# EAGLE design LEDWatchsch (EAGLE 9.6.2)
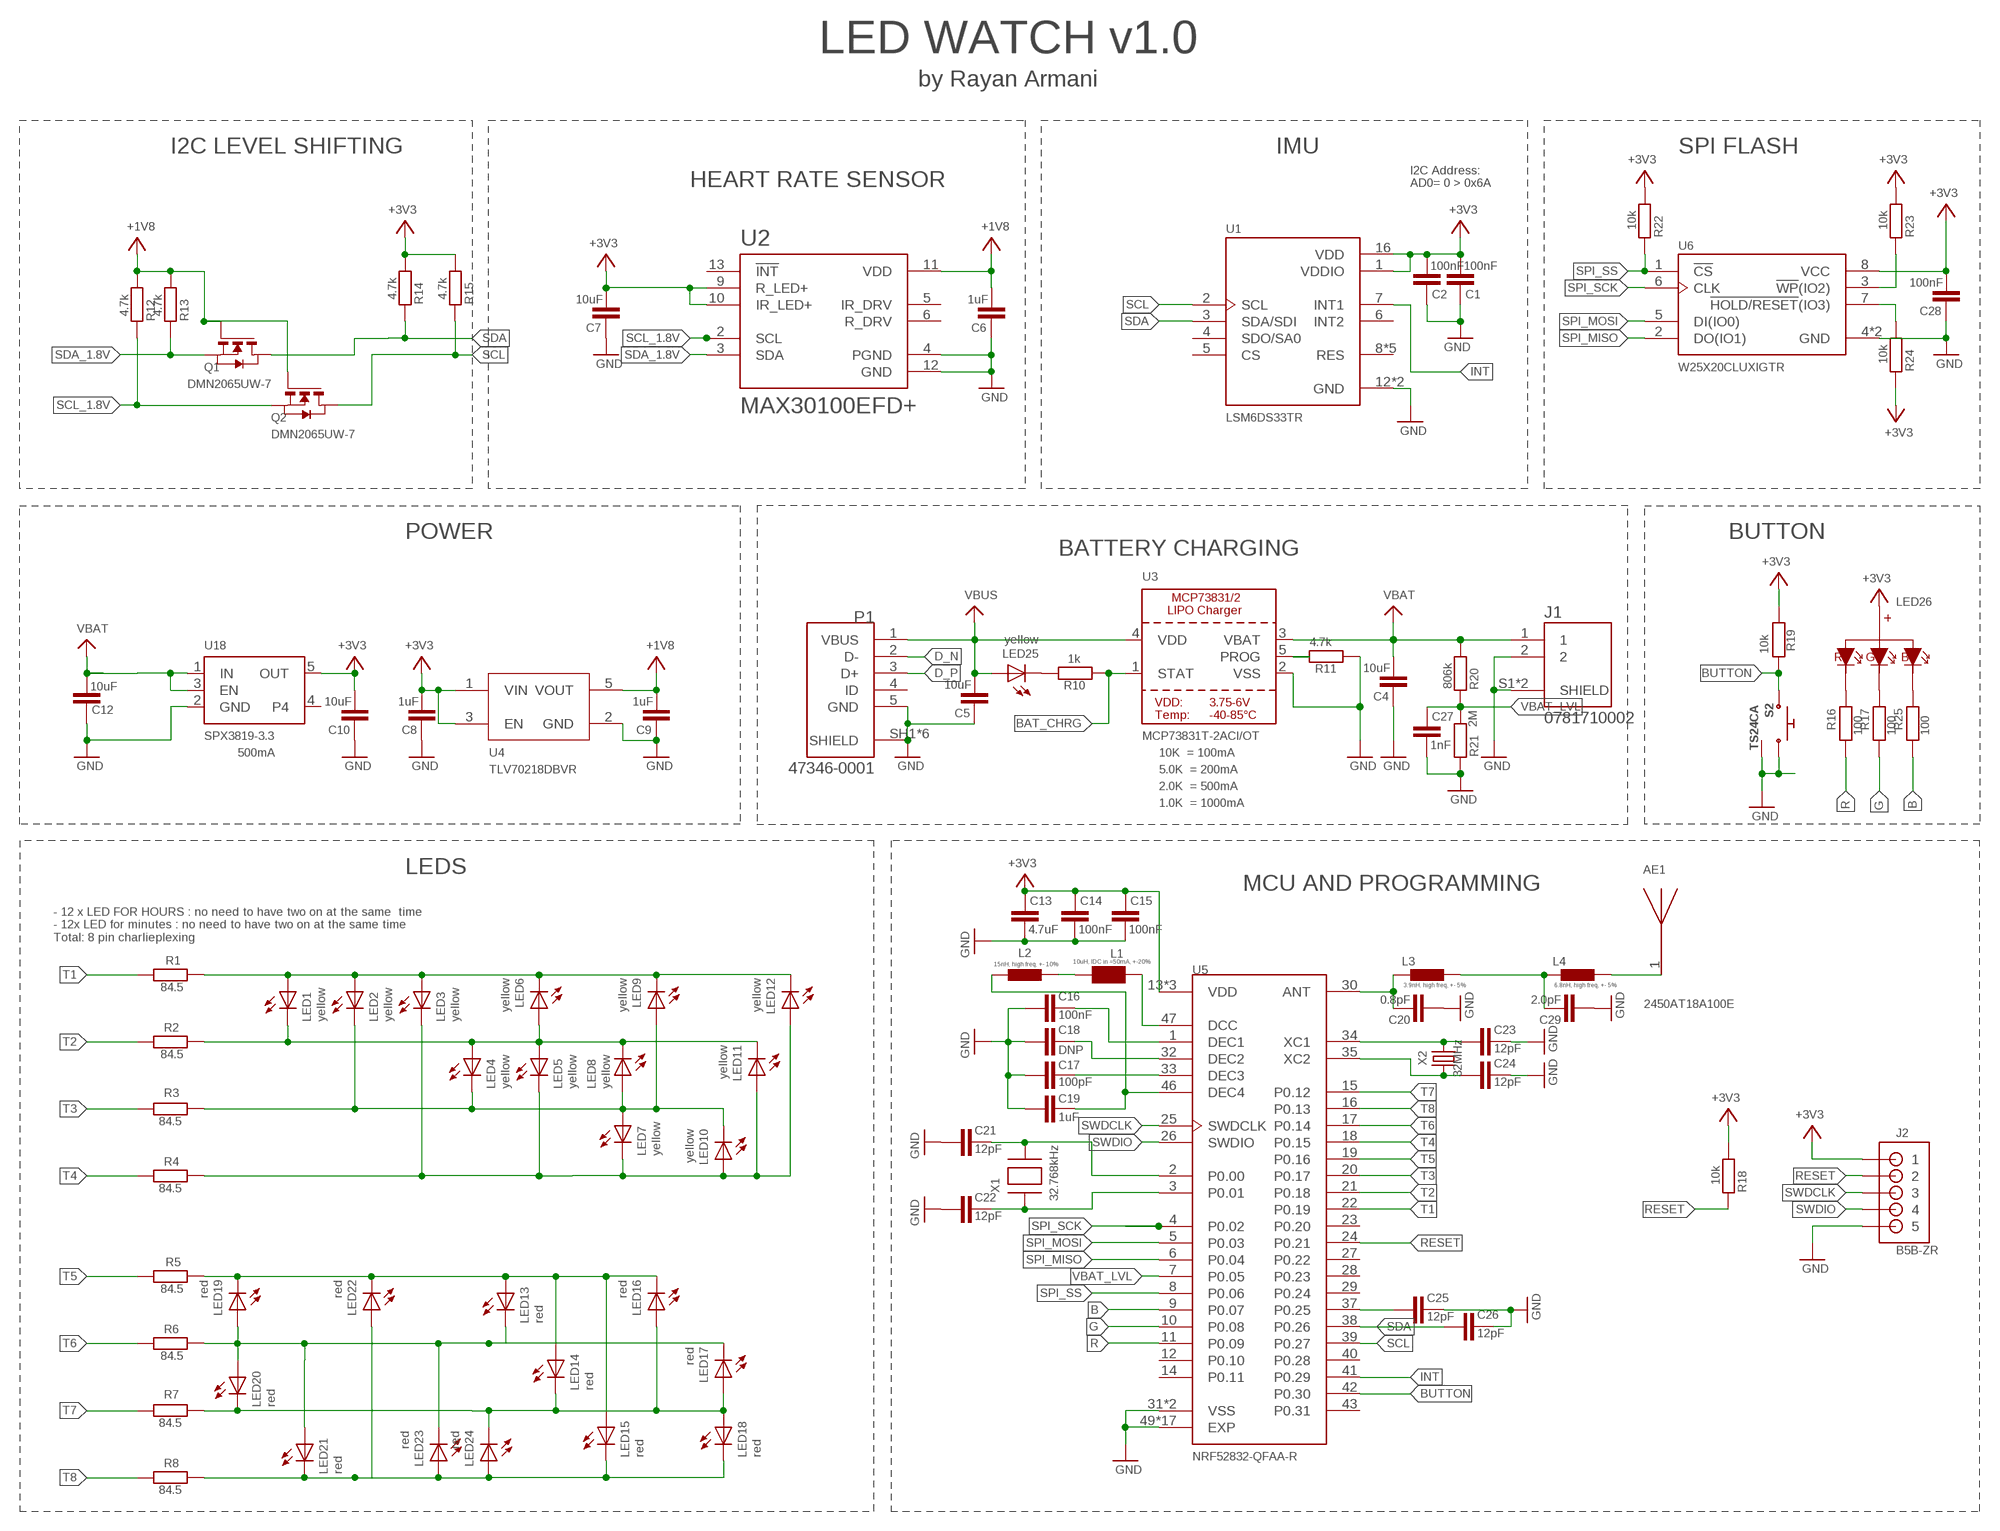
[diagram p0: schematic, sheet 1]

## Parts
AE1  2450AT18A100E  [ANTC3216X140N]
C1  100nF  C-EUC0402K  [C0402K]
C2  100nF  C-EUC0402K  [C0402K]
C4  10uF  C-EUC0402  [C0402]
C5  10uF  C-EUC0402  [C0402]
C6  1uF  C-EUC0402K  [C0402K]
C7  10uF  C-EUC0402  [C0402]
C8  1uF  C-EUC0402K  [C0402K]
C9  1uF  C-EUC0402K  [C0402K]
C10  10uF  C-EUC0402  [C0402]
C12  10uF  C-EUC0402  [C0402]
C13  4.7uF  C-EUC0603  [C0603]
C14  100nF  C-EUC0402  [C0402]
C15  100nF  C-EUC0402K  [C0402K]
C16  100nF  C-EUC0402  [C0402]
C17  100pF  C-EUC0402  [C0402]
C18  DNP  C-EUC0402  [C0402]
C19  1uF  C-EUC0603  [C0603]
C20  0.8pF  C-EUC0402  [C0402]
C21  12pF  C-EUC0402  [C0402]
C22  12pF  C-EUC0402  [C0402]
C23  12pF  C-EUC0402  [C0402]
C24  12pF  C-EUC0402  [C0402]
C25  12pF  C-EUC0402  [C0402]
C26  12pF  C-EUC0402  [C0402]
C27  1nF  C-EUC0402K  [C0402K]
C28  100nF  C-EUC0402K  [C0402K]
C29  2.0pF  C-EUC0402  [C0402]
J1  0781710002  [MOLEX_0781710002]
J2  B5B-ZR  [B5B-ZR]
L1  10uH, IDC in =50mA, +-20%  WUERTH-ELEKTRONIK_WE-CBF_0603  [WUERTH-ELEKTRONIK_0603]
L2  15nH, high freq, +- 10%  BLM15HB121SN1  [0402]
L3  3.9nH, high freq, +- 5%  BLM15HB121SN1  [0402]
L4  6.8nH, high freq, +- 5%  BLM15HB121SN1  [0402]
LED1  yellow  LEDCHIPLED_0603  [CHIPLED_0603]
LED2  yellow  LEDCHIPLED_0603  [CHIPLED_0603]
LED3  yellow  LEDCHIPLED_0603  [CHIPLED_0603]
LED4  yellow  LEDCHIPLED_0603  [CHIPLED_0603]
LED5  yellow  LEDCHIPLED_0603  [CHIPLED_0603]
LED6  yellow  LEDCHIPLED_0603  [CHIPLED_0603]
LED7  yellow  LEDCHIPLED_0603  [CHIPLED_0603]
LED8  yellow  LEDCHIPLED_0603  [CHIPLED_0603]
LED9  yellow  LEDCHIPLED_0603  [CHIPLED_0603]
LED10  yellow  LEDCHIPLED_0603  [CHIPLED_0603]
LED11  yellow  LEDCHIPLED_0603  [CHIPLED_0603]
LED12  yellow  LEDCHIPLED_0603  [CHIPLED_0603]
LED13  red  LEDCHIPLED_0603  [CHIPLED_0603]
LED14  red  LEDCHIPLED_0603  [CHIPLED_0603]
LED15  red  LEDCHIPLED_0603  [CHIPLED_0603]
LED16  red  LEDCHIPLED_0603  [CHIPLED_0603]
LED17  red  LEDCHIPLED_0603  [CHIPLED_0603]
LED18  red  LEDCHIPLED_0603  [CHIPLED_0603]
LED19  red  LEDCHIPLED_0603  [CHIPLED_0603]
LED20  red  LEDCHIPLED_0603  [CHIPLED_0603]
LED21  red  LEDCHIPLED_0603  [CHIPLED_0603]
LED22  red  LEDCHIPLED_0603  [CHIPLED_0603]
LED23  red  LEDCHIPLED_0603  [CHIPLED_0603]
LED24  red  LEDCHIPLED_0603  [CHIPLED_0603]
LED25  yellow  LEDCHIPLED_0603  [CHIPLED_0603]
LED26  RGB_CAV1  [19-037A/RSGHBHW]
P1  47346-0001  [MOLEX_47346-0001]
Q1  DMN2065UW-7  NMOS-SOT323  [SOT323]
Q2  DMN2065UW-7  NMOS-SOT323  [SOT323]
R1  84.5  R-EU_R0402  [R0402]
R2  84.5  R-EU_R0402  [R0402]
R3  84.5  R-EU_R0402  [R0402]
R4  84.5  R-EU_R0402  [R0402]
R5  84.5  R-EU_R0402  [R0402]
R6  84.5  R-EU_R0402  [R0402]
R7  84.5  R-EU_R0402  [R0402]
R8  84.5  R-EU_R0402  [R0402]
R10  1k  R-EU_R0402  [R0402]
R11  4.7k  R-EU_R0402  [R0402]
R12  4.7k  R-EU_R0402  [R0402]
R13  4.7k  R-EU_R0402  [R0402]
R14  4.7k  R-EU_R0402  [R0402]
R15  4.7k  R-EU_R0402  [R0402]
R16  100  R-EU_R0402  [R0402]
R17  100  R-EU_R0402  [R0402]
R18  10k  R-EU_R0402  [R0402]
R19  10k  R-EU_R0402  [R0402]
R20  806k  R-EU_R0402  [R0402]
R21  2M  R-EU_R0402  [R0402]
R22  10k  R-EU_R0402  [R0402]
R23  10k  R-EU_R0402  [R0402]
R24  10k  R-EU_R0402  [R0402]
R25  100  R-EU_R0402  [R0402]
S2  TS24CA  PUSHBUTTON_SHIELDED_NH  [TS24CCA_NOHOLE]
U1  LSM6DS33TR  [PQFN50P300X300X86-16N]
U2  MAX30100EFD+  [LGA14R80P2X7_560X280X130]
U3  MCP73831T-2ACI/OT  MCP73831/2  [SOT23-5]
U4  TLV70218DBVR  TLV702TLV702  [SOT95P280X145-5N]
U5  NRF52832-QFAA-R  [QFN40P600X600X90-49N]
U6  W25X20CLUXIGTR  [SON50P300X200X60-9N]
U18  SPX3819-3.3  VREG_SOT23-5  [SOT23-5]
X1  32.768kHz  XTAL-3.2X1.5  [XTAL3215]
X2  32MHz  KX-5  [2.0X1.6_KX-5]

## Nets
+3V3: C1.2 C2.2 C7.2 C8.2 C10.2 C13.1 C14.1 C15.1 C28.2 J2.1 LED26.A R14.1 R15.1 R18.1 R19.1 R22.1 R23.1 R24.2 U1.1(VDDIO) U1.16(VDD) U2.9(R_LED+) U2.10(IR_LED+) U4.1(VIN) U4.3(EN) U5.13(VDD) U5.36(VDD) U5.48(VDD) U6.8(VCC) U18.5(OUT)
ANT: C29.1 L3.2 L4.1
B: R25.1 U5.9(P0.07)
BAT_CHRG: R10.1 U3.1(STAT)
BUTTON: R19.2 S2.1 U5.42(P0.30)
D_N: P1.2(D-)
D_P: P1.3(D+)
G: R17.1 U5.10(P0.08)
GND: C1.1 C2.1 C4.1 C5.1 C6.1 C7.1 C8.1 C9.1 C10.1 C12.1 C13.2 C14.2 C15.2 C16.2 C17.2 C18.2 C19.1 C20.2 C21.2 C22.2 C23.1 C24.1 C25.1 C26.1 C27.2 C28.1 C29.2 J1.2 J1.S1(SHIELD) J1.S2(SHIELD) J2.5 P1.5(GND) P1.SH1(SHIELD) P1.SH2(SHIELD) P1.SH3(SHIELD) P1.SH4(SHIELD) P1.SH5(SHIELD) P1.SH6(SHIELD) R11.1 R21.2 S2.2 S2.P$3(SHIELD) S2.P$4(SHIELD) U1.12(GND) U1.13(GND) U2.4(PGND) U2.12(GND) U3.2(VSS) U4.2(GND) U5.31(VSS) U5.45(VSS) U5.49(EXP) U5.50(EXP) U5.51(EXP) U5.52(EXP) U5.53(EXP) U5.54(EXP) U5.55(EXP) U5.56(EXP) U5.57(EXP) U5.58(EXP) U5.59(EXP) U5.60(EXP) U5.61(EXP) U5.62(EXP) U5.63(EXP) U5.64(EXP) U5.65(EXP) U6.4(GND) U6.9(GND) U18.2(GND)
H1: LED1.A LED2.A LED3.A LED6.C LED9.C LED12.C R1.2
H2: LED1.C LED4.A LED5.A LED6.A LED8.C LED11.C R2.2
H3: LED2.C LED4.C LED7.A LED8.A LED9.A LED10.C R3.2
H4: LED3.C LED5.C LED7.C LED10.A LED11.A LED12.A R4.2
H5: LED13.A LED14.A LED15.A LED16.C LED19.C LED22.C R5.2
H6: LED13.C LED17.C LED19.A LED20.A LED21.A LED23.C R6.2
H7: LED14.C LED16.A LED17.A LED18.A LED20.C LED24.C R7.2
H8: LED15.C LED18.C LED21.C LED22.A LED23.A LED24.A R8.2
INT: U1.7(INT1) U5.41(P0.29)
N$3: LED25.C R10.2
N$4: C16.1 U5.1(DEC1)
N$5: R11.2 U3.5(PROG)
N$6: C18.1 U5.32(DEC2)
N$7: LED26.B R25.2
N$8: C17.1 U5.33(DEC3)
N$9: C19.2 L2.2 U5.46(DEC4)
N$10: L1.1 U5.47(DCC)
N$11: L1.2 L2.1
N$12: C20.1 L3.1 U5.30(ANT)
N$13: C21.1 U5.2(P0.00) X1.P$2
N$14: C22.1 U5.3(P0.01) X1.P$1
N$15: C23.2 U5.34(XC1) X2.3
N$16: C24.2 U5.35(XC2) X2.1
N$17: C25.2 U5.37(P0.25)
N$18: R23.2 U6.3(!WP!(IO2))
N$19: R24.1 U6.7(!HOLD/RESET!(IO3))
N$20: AE1.1 L4.2
N$21: LED26.R R16.2
N$22: LED26.G R17.2
R: R16.1 U5.11(P0.09)
RESET: J2.2 R18.2 U5.24(P0.21)
SCL: Q2.3(D) R15.2 U1.2(SCL) U5.39(P0.27)
SCL_1.8V: Q2.2(S) R12.2 U2.2(SCL)
SDA: C26.2 Q1.3(D) R14.2 U1.3(SDA/SDI) U5.38(P0.26)
SDA_1.8V: Q1.2(S) R13.2 U2.3(SDA)
SPI_MISO: U5.6(P0.04) U6.2(DO(IO1))
SPI_MOSI: U5.5(P0.03) U6.5(DI(IO0))
SPI_SCK: U5.4(P0.02) U6.6(CLK)
SPI_SS: R22.2 U5.8(P0.06) U6.1(!CS)
SWDCLK: J2.3 U5.25(SWDCLK)
SWDIO: J2.4 U5.26(SWDIO)
T1: R1.1 U5.22(P0.19)
T2: R2.1 U5.21(P0.18)
T3: R3.1 U5.20(P0.17)
T4: R4.1 U5.18(P0.15)
T5: R5.1 U5.19(P0.16)
T6: R6.1 U5.17(P0.14)
T7: R7.1 U5.15(P0.12)
T8: R8.1 U5.16(P0.13)
VBAT: C4.2 C12.2 J1.1 R20.1 U3.3(VBAT) U18.1(IN) U18.3(EN)
VBAT_LVL: C27.1 R20.2 R21.1 U5.7(P0.05)
VBUS: C5.2 LED25.A P1.1(VBUS) U3.4(VDD)
VCC: C6.2 C9.2 Q1.1(G) Q2.1(G) R12.1 R13.1 U2.11(VDD) U4.5(VOUT) ; supply symbol labelled +1V8
Unconnected: P1.4(ID) U1.4(SDO/SA0) U1.5(CS) U1.6(INT2) U1.8(RES) U1.9(RES) U1.10(RES) U1.11(RES) U1.15(RES) U2.5(IR_DRV) U2.6(R_DRV) U2.13(!INT) U5.12(P0.10) U5.14(P0.11) U5.23(P0.20) U5.27(P0.22) U5.28(P0.23) U5.29(P0.24) U5.40(P0.28) U5.43(P0.31) U18.4

## Notes on the sheet
- LED WATCH v1.0
- by Rayan Armani
- I2C LEVEL SHIFTING | IMU | SPI FLASH
- HEART RATE SENSOR
- I2C Address: 
  AD0= 0 > 0x6A
- POWER | BUTTON
- BATTERY CHARGING
- 500mA | 10K  = 100mA
- 5.0K  = 200mA
- 2.0K  = 500mA
- 1.0K  = 1000mA
- LEDS
- MCU AND PROGRAMMING
- - 12 x LED FOR HOURS : no need to have two on at the same  time
  - 12x LED for minutes : no need to have two on at the same time 
  Total: 8 pin charlieplexing

## Library data of the parts
AE1 = 2450AT18A100E:2450AT18A100E: ANTENNA, CERAMIC, 2.45GHZ; Bandwidth: 100MHz; Frequency: 2.45GHz; Gain: -0.5dB; Impedance: 50ohm; AVAILABILITY: Unavailable; DESCRIPTION: 2.4GHz Chip RF Antenna 2.4GHz ~ 2.5GHz 0.5dBi Solder Surface Mount; MF: Johanson Technology; MP: 2450AT18A100E; PACKAGE: FBGA-780 Johanson; PRICE: None
C1 C2 C4-C10 C12-C29 = rcl:C-EU: CAPACITOR, European symbol; SPICEPREFIX: C
J1 = Molex_picoblade:0781710002: Conn Wire to Board HDR 2 POS 1.2mm Solder ST SMD; AVAILABILITY: Unavailable; DESCRIPTION: Connector Header Surface Mount 2 position 0.047 _1.20mm_; MF: Molex; MP: 0781710002; PACKAGE: None; PRICE: None
J2 = con-jst-zh:B5B-ZR: JST-ZH Connector 5 pol, 1.5mm pitch Package: B5B-ZR Source: http://www.jst-mfg.com/product/pdf/eng/eZH.pdf
L1 = Arduino_Micro:WUERTH-ELEKTRONIK_WE-CBF: SMD EMI Suppression Ferrite Beads - excellent anti-EMI properties - low DCR - impedances till 3000 ohms - rated current up to 6 A
L2-L4 = inductors:BLM15H: EMIFIL (R) Chip Ferrite Bead for GHz Noise Source: http://www.murata.com/ Ferrite Bead BLM15H.pdf
LED1-LED25 = adafruit:LED: LED OSRAM: - CHIPLED LG R971, LG N971, LY N971, LG Q971, LY Q971, LO R971, LY R971 LH N974, LH R974 LS Q976, LO Q976, LY Q976 LO Q996 - Hyper CHIPLED LW Q18S LB Q993, LB Q99A, LB R99A - SideLED LS A670, LO A670, LY A670, LG A670, LP A670 LB A673, LV A673, LT A673, LW A673 LH A674 LY A675 LS A676, LA A676, LO A676, LY A676, LW A676 LS A679, LY A679, LG A679 - Hyper Micro SIDELED® LS Y876, LA Y876, LO Y876, LY Y876 LT Y87S - SmartLED LW L88C, LW L88S LB L89C, LB L89S, LG L890 LS L89K, LO L89K, LY L89K LS L896, LA L896, LO L896, LY L896 - TOPLED LS T670, LO T670, LY T670, LG T670, LP T670 LSG T670, LSP T670, LSY T670, LOP T670, LYG T670 LG T671, LOG T671, LSG T671 LB T673, LV T673, LT T673, LW T673 LH T674 LS T676, LA T676, LO T676, LY T676, LB T676, LH T676, LSB T676, LW T676 LB T67C, LV T67C, LT T67C, LS T67K, LO T67K, LY T67K, LW E67C LS E67B, LA E67B, LO E67B, LY E67B, LB E67C, LV E67C, LT E67C LW T67C LS T679, LY T679, LG T679 LS T770, LO T770, LY T770, LG T770, LP T770 LB T773, LV T773, LT T773, LW T773 LH T774 LS E675, LA E675, LY E675, LS T675 LS T776, LA T776, LO T776, LY T776, LB T776 LHGB T686 LT T68C, LB T68C - Hyper Mini TOPLED® LB M676 - Mini TOPLED Santana® LG M470 LS M47K, LO M47K, LY M47K Source: http://www.osram.convergy.de/
LED26 = RGB:RGB_CA
P1 = 47346-0001:47346-0001: CONN RCPT 5POS MICRO USB R/A SMD; AVAILABILITY: Unavailable; DESCRIPTION: USB - micro B USB 2.0 Receptacle Connector 5 Position Surface Mount, Right Angle; MF: Molex; MP: 47346-0001; PACKAGE: None; PRICE: None
Q1 Q2 = MOSFET:NMOS: N-Channel MOSFET
R1-R8 R10-R25 = rcl:R-EU_: RESISTOR, European symbol; SPICEPREFIX: R
S2 = Inbolt:PUSHBUTTON_SHIELDED
U1 = LSM6DS33TR:LSM6DS33TR: Integrated Circuit, Misc s 3d Accelerometer And Gyro Lsm6ds3; AVAILABILITY: Unavailable; DESCRIPTION: Integrated Circuit, Misc s 3d Accelerometer And Gyro Lsm6ds3; MF: STMicroelectronics; MP: LSM6DS33TR; PACKAGE: LGA-16 STMicroelectronics; PRICE: None
U2 = MAX30100EFD:MAX30100EFD+: Pulse Oximeter and Heart-Rate Sensor IC 14-Pin OLGA; AVAILABILITY: Unavailable; DESCRIPTION: Oximeter/Heart Rate Sensor Output; MF: Maxim Integrated; MP: MAX30100EFD+T; PACKAGE: None; PRICE: None
U3 = microbuilder:MCP73831/2: MCP73831/2 LIPO Charger VDD: 3.75 - 6V Temp -40 - 85°C Programmable Charge Rate: 15-500mA NOTE: STAT is a tri-state logic output on the MCP73831 and an open-drain output on the MCP73832. SOT23-5 with 4.2V output and tri-state logic on STAT = MCP73831T-2ACI/OT
U4 = Inbolt:TLV702
U5 = NRF52832-QFAA-R:NRF52832-QFAA-R: Bluetooth SMART SOC IoT 2000Mbps 48-Pin QFN EP T/R; AVAILABILITY: Unavailable; DESCRIPTION: IC RF TxRx + MCU Bluetooth, General ISM > 1GHz ANT, Bluetooth v5.0 2.4GHz 48-VFQFN Exposed Pad; MF: Nordic; MP: NRF52832-QFAA-R; PACKAGE: VFQFN-48 Nordic; PRICE: None
U6 = Memory:W25X20CLUXIGTR
U18 = microbuilder:VREG_SOT23-5: SOT23-5 Fixed Voltage Regulators Part Current Out V Out V In V Dropout θJA (°C/W) TJ (°C) Digikey Part No. ADP121 150mA 3.3V 3.4-5.5V 0.09V @ 150mA -- -- ADP121-AUJZ33R7CT-ND ADP121 150mA 3.0V 3.1-5.5V 0.09V @ 150mA -- -- ADP121-AUJZ30R7CT-ND ADP122 300mA 3.3V 3.4-5.5V 0.085V @ 300mA -- -- ADP122AUJZ-3.3-R7CT-ND ADP1712 300mA 3.3V 3.5-5.5V 0.17V @ 300mA -- -- ADP1712AUJZ-3.3-R7TR-ND AP7311 (Low Cost) 150mA 3.3V 3.5-6V 0.15V @ 150mA -- -- AP7311-33WG-7DICT-ND LD39015M18R 150mA 1.8V 1.9V-5.5V 0.08V @ 100mA -- -- 497-6977-1-ND LP2985A-33DBVR 150mA 3.3V 3.3-16V 0.28V @ 150mA 206 150 296-18479-1-ND MCP1824T-3302E/OT 300mA 3.3V 3.5V-6V 0.2V @ 300mA -- -- MCP1824T-3302E/OTCT-ND MIC5205-2.5YM5 TR 150mA 2.5V 2.7-16V 0.165V @ 150mA -- -- 576-1257-2-ND MIC5205-3.0YM5 TR 150mA 3.0V 3.2V-16V 0.165V @ 150mA -- -- 576-1258-2-ND MIC5205-3.3YM5 TR 150mA 3.3V 3.5V-16V 0.165V @ 150mA -- -- 576-1259-2-ND TPS780330220 150mA 3.3V+2.2V 3.6-5.5V 250mV Max -- -- 296-23332-1-ND TDA3663/N1,135 100mA 3.3V 3.5-45V 0.18V @ 50mA -- -- 568-5343-1-ND Max operating temp can be calculated using θJA, TJ (max junction temperature), and power in watts. Set the "Maximum Ambient Temperature" until it reaches TJ ("Max Junction Temperature"), which is the absolute limit for safe use of the regulator: Heat Sink Temperature Calculator <http://www.daycounter.com/Calculators/Heat-Sink-Temperature-Calculator.phtml> For example, With 12V source into a 3.3V LP2985 and a 30mA load, we are dissipating (12V-3.3V) * 0.03A = 0.261W. With a θJA of 206 °C/W, a TJ of 150°C, and 261mW we can safely use the chip without a heat sink up to 75°C (=147.1°C Junction Temperature).
X1 = adafruit:XTAL: Low cost SMT crystals, no capacitors included http://www.ladyada.net/library/eagle
X2 = crystal-geyer_V1_0:KX: Quartz Crystals (MHz) SMD: KX - Serie Model Size l/w/h [mm] Frequency Range Frequency Stability Temp. Range [°C] Load Capacitance AECQ 200 availabel Datasheet KX-4 KX-5 KX-6 KX-7 KX-9A KX-9B KX-12A KX-12B KX-13 KX-20 KX-K KX-KS 1.6/1.2/0.3 2.0/1.6/0.45 2.5/2.0/0.55 3.2/2.5/0.8 5.0/3.2/1.0 5.0/3.2/1.1 6.0/3.5/1.1 6.0/3.5/1.0 7.0/5.0 /1.3 11.6/5.5/1.6 12.3/4.5/4.2 12.3/4.5/3.2 24.0 ~ 80.0 MHz 16.0 ~ 80.0 MHz 12.0 ~ 80.0 MHz 8.0 ~ 60.0 MHz 7,68 ~ 300,0 MHz 8,0 ~ 50,0 MHz 8,0 ~ 150,0 MHz 8,0 ~ 50,0 MHz 6,0 ~ 160,0 MHz 3,579 ~ 25,0 MHz 3,579 ~ 70,0 MHz 3,579 ~ 70,0 MHz ±10 … ±50ppm ±10 … ±50ppm ±10 … ±50ppm ±10 … ±50ppm ±10 … ±50ppm ±10 … ±50ppm ±10 … ±50ppm ±10 … ±50ppm ±10 … ±50ppm ±50ppm ±10 … ±50ppm ±10 … ±50ppm (*) -40°C …+85°C (*) -40°C …+125°C (*) -40°C …+125°C (*) -40°C …+125°C (*) -40°C …+105°C (*) -40°C …+105°C (*) -40°C …+125°C (*) -40°C …+105°C (*) -40°C …+105°C (*) -40°C …+105°C (*) -40°C …+85°C (*) -40°C …+85°C 8, 8…16 8, 8…16 10, 8…16 12, 7…20 16, 10…20 16, 10…20 16, 10…20 16, 12…20 16, 12…20 16, 12…20 16, 12…30 16, 12…30 - yes yes yes - - - - - - - - KX-4.pdf <http://www.geyer-electronic.de/uploads/tx_userartikelfrequenz/GEYER-KX-4.pdf> KX-5.pdf <http://www.geyer-electronic.de/uploads/tx_userartikelfrequenz/GEYER-KX-5.pdf> KX-6.pdf <http://www.geyer-electronic.de/uploads/tx_userartikelfrequenz/GEYER-KX-6.pdf> KX-7.pdf <http://www.geyer-electronic.de/uploads/tx_userartikelfrequenz/GEYER-KX-7.pdf> KX-9A.pdf <http://www.geyer-electronic.de/uploads/tx_userartikelfrequenz/GEYER-KX-9A.pdf> KX-9B.pdf <http://www.geyer-electronic.de/uploads/tx_userartikelfrequenz/GEYER-KX-9B.pdf> KX-12A.pdf <http://www.geyer-electronic.de/uploads/tx_userartikelfrequenz/GEYER-KX-12A.pdf> KX-12B.pdf <http://www.geyer-electronic.de/uploads/tx_userartikelfrequenz/GEYER-KX-12B.pdf> KX-13.pdf <http://www.geyer-electronic.de/uploads/tx_userartikelfrequenz/GEYER-KX-13.pdf> KX-20.pdf <http://www.geyer-electronic.de/uploads/tx_userartikelfrequenz/GEYER-KX-20.pdf> KX-K.pdf <http://www.geyer-electronic.de/uploads/tx_userartikelfrequenz/GEYER-KX-K.pdf> KX-KS.pdf <http://www.geyer-electronic.de/uploads/tx_userartikelfrequenz/GEYER-KX-KS.pdf> <http://www.geyer-electronic.de/fileadmin/template/img/logo-geyer-electronic.png> Details see: http://www.geyer-electronic.de/Frequenz-Produkte.9.0.html Created 2016-06-07, Hans Locher 2016 (C) Geyer Quartz Technology KX4,KX5,KX6,KX7,KX9A,KX9B,KX12A,KX12B,KX13,KX20,KXK,KXKS;1612;2016;2520;3225;5032;6035;7050;11655;12345;1,6x1,2;2,0x1,6;2,5x2,0;3,2x2,5;5,0x3,2;6,0x3,5;7,0x5,0;11,6x5,5;12,3x4,5;12,3x4,5;1.6x1.2;2.0x1.6;2.5x2.0;3.2x2.5;5.0x3.2;6.0x3.5;7.0x5.0;11.6x5.5;12.3x4.5;12.3x4.5;

## Net classes
0 default: width 0.152 mm, drill 0.3 mm, clearance 0.152 mm

## Board
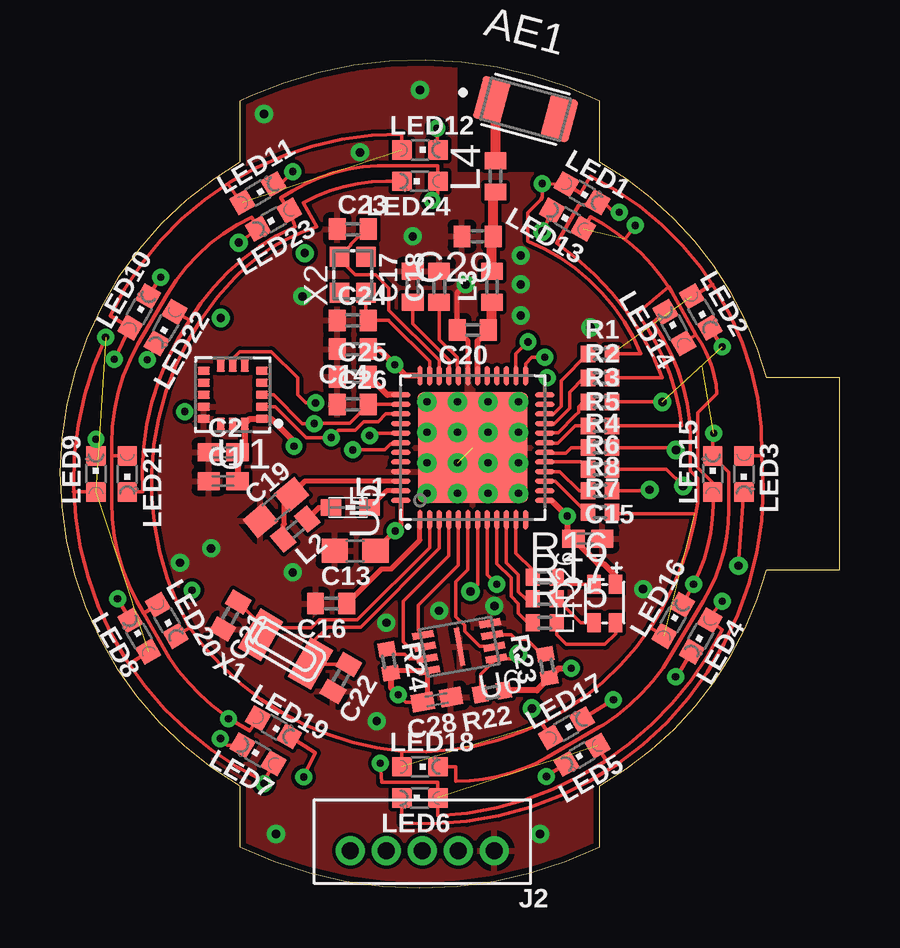
[diagram p1: board, top side]
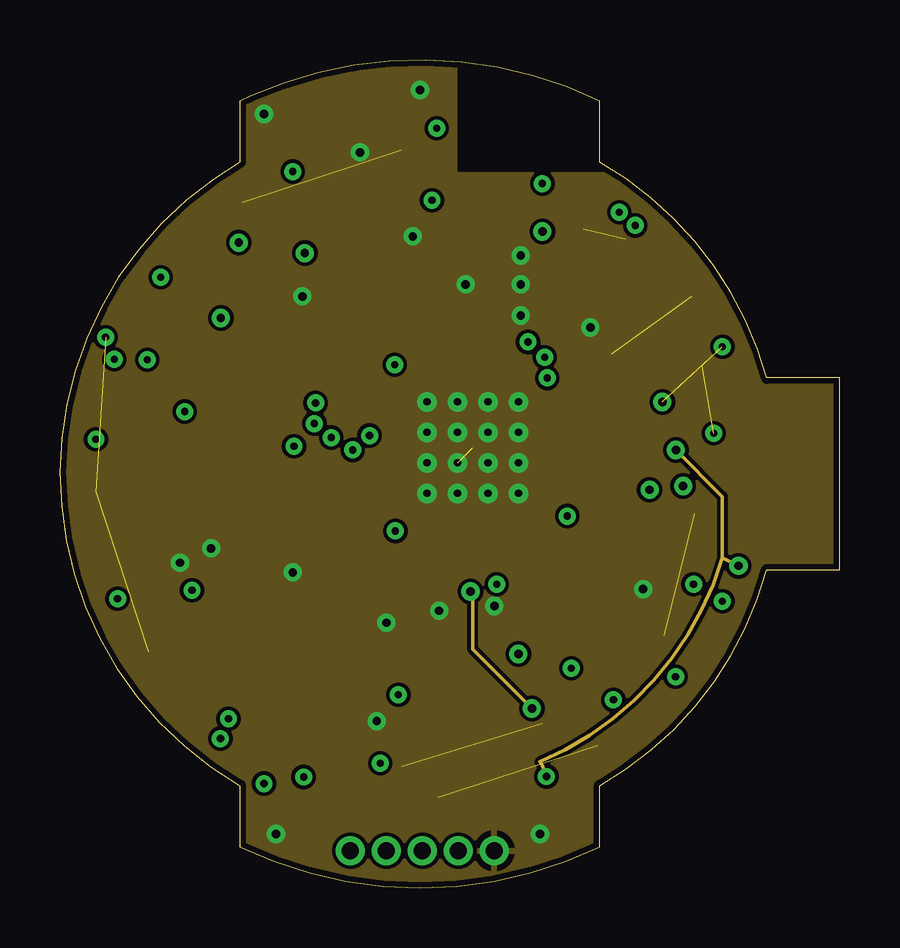
[diagram p2: board, inner layer GND]
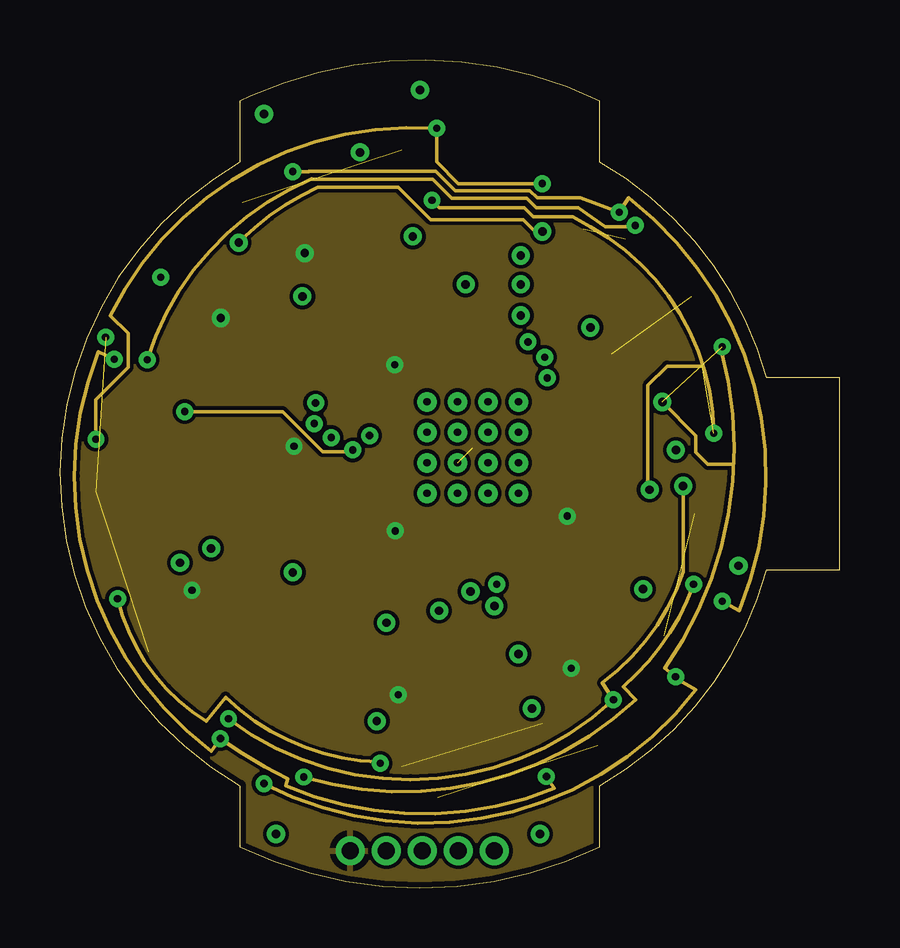
[diagram p3: board, inner layer VDD]
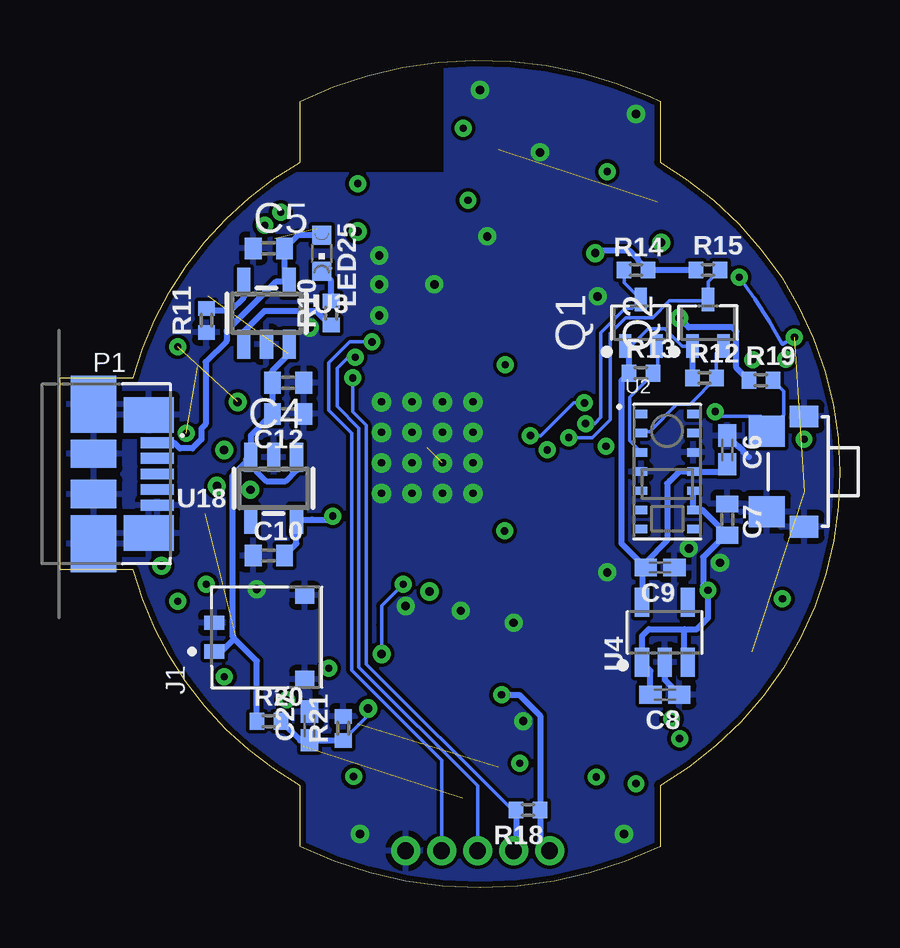
[diagram p4: board, bottom side, seen from below]

Size 32.5 x 34.5 mm. Coordinates in mm from the lower left corner, seen from the top.
Outline: 7.5,1.72 arc52 22.5,1.72 22.5,4.26 23.6,4.96 arc40 29.46,13.25 32.5,13.25 32.5,21.25 29.46,21.25 29.05,22.49 arc40 22.5,30.24 22.5,32.78 21.12,33.38 arc45 7.92,32.98 7.5,32.78 7.5,30.24 6.4,29.54 arc115 7.5,4.26 7.5,1.72
Copper layers (1+2*15+16): Top 0.04mm / dielectric 0.2mm / GND 0.04mm / dielectric 0.24mm / VDD 0.04mm / dielectric 0.2mm / Bottom 0.04mm
Design rules "default *": minimum track width 6mil, minimum drill 0.3mm, track to track 5mil, track to pad 5mil, pad to pad 5mil, via to via 5mil, smd to smd 5mil, copper to edge 10mil, drill to drill 6mil, minimum pad ring 10mil, minimum via ring 8mil, stop-mask expansion 4mil, vias tented up to drill 0.3mm, thermal gap 10mil

### Footprints (pad centres in the part's own frame; a part is rotated, then mirrored left to right if it is on the bottom)
ANTC3216X140N = smd 1.2 x 1.82: 1 -1.46,0; 2 1.46,0
C0402K = smd 0.925 x 0.74: 1 -0.6,0; 2 0.6,0
C0402 = smd 0.7 x 0.9: 1 -0.65,0; 2 0.65,0
C0603 = smd 1.1 x 1: 1 -0.85,0; 2 0.85,0
MOLEX_0781710002 = smd 0.6 x 0.85: 1 -0.6,3.775; 2 0.6,3.775 | smd 0.7 x 0.8: S1 -1.75,0; S2 1.75,0
B5B-ZR = drill 0.7: 1 7.5,-1.3; 2 6,-1.3; 3 4.5,-1.3; 4 3,-1.3; 5 1.5,-1.3
WUERTH-ELEKTRONIK_0603 = smd 0.85 x 0.7: 1 -0.9,0; 2 0.7,0
0402 = smd 0.7 x 0.9: 1 -0.65,0; 2 0.65,0
CHIPLED_0603 = smd 0.8 x 0.8: A 0,-0.75; C 0,0.75
19-037A/RSGHBHW = smd 0.8 x 0.55: A 0.8,-0.45; B -0.8,-0.45; G -0.8,0.45; R 0.8,0.45
MOLEX_47346-0001 = smd 0.45 x 1.38: 1 -1.3,2.66; 2 -0.65,2.66; 3 0,2.66; 4 0.65,2.66; 5 1.3,2.66 | smd 1.475 x 2.1: SH1 -2.462,2.3; SH2 2.462,2.3 | smd 2.375 x 1.9: SH3 -2.913,0; SH6 2.913,0 | smd 1.175 x 1.9: SH4 -0.838,0; SH5 0.838,0
SOT323 = smd 0.988 x 0.51: 1 -0.97,0.65; 2 -0.97,-0.65; 3 0.97,0
R0402 = smd 0.6 x 0.7: 1 -0.5,0; 2 0.5,0
TS24CCA_NOHOLE = smd 1.3 x 1.5: 1 -1.675,-1.55; 2 1.675,-1.55 | smd 0.9 x 1.2: P$3 -2.3,0; P$4 2.3,0
PQFN50P300X300X86-16N = smd 0.51 x 0.35: 1 -1.21,1; 2 -1.21,0.5; 3 -1.21,0; 4 -1.21,-0.5; 5 -1.21,-1; 9 1.21,-1; 10 1.21,-0.5; 11 1.21,0; 12 1.21,0.5; 13 1.21,1 | smd 0.35 x 0.51: 6 -0.5,-1.21; 7 0,-1.21; 8 0.5,-1.21; 14 0.5,1.21; 15 0,1.21; 16 -0.5,1.21
LGA14R80P2X7_560X280X130 = smd 0.5 x 0.35: 1 -1.075,2.4; 2 -1.075,1.6; 3 -1.075,0.8; 4 -1.075,0; 5 -1.075,-0.8; 6 -1.075,-1.6; 7 -1.075,-2.4; 8 1.075,-2.4; 9 1.075,-1.6; 10 1.075,-0.8; 11 1.075,0; 12 1.075,0.8; 13 1.075,1.6; 14 1.075,2.4
SOT23-5 = smd 0.55 x 1.2: 1 -0.95,-1.3; 2 0,-1.3; 3 0.95,-1.3; 4 0.95,1.3; 5 -0.95,1.3
SOT95P280X145-5N = smd 1.216 x 0.589: 1 -1.25,0.95; 2 -1.25,0; 3 -1.25,-0.95; 4 1.25,-0.95; 5 1.25,0.95
QFN40P600X600X90-49N = smd 0.8 x 0.2: 1 -3,2.2; 2 -3,1.8; 3 -3,1.4; 4 -3,1; 5 -3,0.6; 6 -3,0.2; 7 -3,-0.2; 8 -3,-0.6; 9 -3,-1; 10 -3,-1.4; 11 -3,-1.8; 12 -3,-2.2; 25 3,-2.2; 26 3,-1.8; 27 3,-1.4; 28 3,-1; 29 3,-0.6; 30 3,-0.2; 31 3,0.2; 32 3,0.6; 33 3,1; 34 3,1.4; 35 3,1.8; 36 3,2.2 | smd 0.2 x 0.8: 13 -2.2,-3; 14 -1.8,-3; 15 -1.4,-3; 16 -1,-3; 17 -0.6,-3; 18 -0.2,-3; 19 0.2,-3; 20 0.6,-3; 21 1,-3; 22 1.4,-3; 23 1.8,-3; 24 2.2,-3; 37 2.2,3; 38 1.8,3; 39 1.4,3; 40 1,3; 41 0.6,3; 42 0.2,3; 43 -0.2,3; 44 -0.6,3; 45 -1,3; 46 -1.4,3; 47 -1.8,3; 48 -2.2,3 | smd 4.6 x 4.6: 49 0,0 | drill 0.305 pad 0.61: 50 -0.635,0.635; 51 0.635,0.635; 52 -0.635,-0.635; 53 0.635,-0.635; 54 0.635,-1.905; 55 -0.635,-1.905; 56 -1.905,-1.905; 57 -1.905,-0.635; 58 -1.905,0.635; 59 -1.905,1.905; 60 -0.635,1.905; 61 0.635,1.905; 62 1.905,1.905; 63 1.905,0.635; 64 1.905,-0.635; 65 1.905,-1.905
SON50P300X200X60-9N = smd 0.89 x 0.3: 1 -1.42,0.75; 2 -1.42,0.25; 3 -1.42,-0.25; 4 -1.42,-0.75; 5 1.42,-0.75; 6 1.42,-0.25; 7 1.42,0.25; 8 1.42,0.75 | smd 0.2 x 1.6: 9 0,0
XTAL3215 = smd 1.1 x 1.9: P$1 1.2,0; P$2 -1.2,0
2.0X1.6_KX-5 = smd 0.85 x 0.8: 1 -0.75,-0.55; 2 0.75,-0.55; 3 0.75,0.55; 4 -0.75,0.55

### Placement (x,y rotation side)
AE1  19.4,32.45 345 top
C1  6.8,16.95 0 top
C2  6.8,18.15 0 top
C4  23,21.05 180 bottom
C5  23.8,26.65 0 bottom
C6  4.7,18.25 270 bottom
C7  4.7,15.35 270 bottom
C8  7.3,8.05 180 bottom
C9  7.5,13.35 180 bottom
C10  23.8,13.85 0 bottom
C12  23,19.75 180 bottom
C13  12.3,14.05 180 top
C14  12.2,22.45 180 top
C15  22,14.55 0 top
C16  11.3,11.85 180 top
C17  14.7,25.05 90 top
C18  15.8,25.05 90 top
C19  9,15.85 40 top
C20  17.2,23.25 180 top
C21  7.1,11.35 240 top
C22  11.7,8.75 240 top
C23  12.2,27.45 0 top
C24  12.2,23.65 0 top
C25  12.2,21.3 0 top
C26  12.2,20.15 0 top
C27  22.1,6.75 90 bottom
C28  15.7,7.85 190 top
C29  17.4,27.15 180 top
J1  22.3,10.45 90 bottom
J2  19.6,0.25 180 top
L1  12,15.85 180 top
L2  9.8,14.95 220 top
L3  18,25.05 90 top
L4  18.15,29.65 90 top
LED1  21.75,28.95 240 top
LED2  26.7,24 210 top
LED3  28.5,17.25 180 top
LED4  26.7,10.5 150 top
LED5  21.75,5.55 120 top
LED6  15,3.75 90 top
LED7  8.25,5.57 60 top
LED8  3.3,10.5 30 top
LED9  1.5,17.25 0 top
LED10  3.3,24 330 top
LED11  8.25,28.95 300 top
LED12  15,30.75 270 top
LED13  21.15,27.85 60 top
LED14  25.6,23.35 30 top
LED15  27.2,17.25 0 top
LED16  25.55,11.15 330 top
LED17  21.1,6.65 300 top
LED18  15,5.05 270 top
LED19  8.9,6.7 240 top
LED20  4.45,11.15 210 top
LED21  2.8,17.25 180 top
LED22  4.4,23.35 150 top
LED23  8.9,27.85 120 top
LED24  15,29.45 90 top
LED25  21.6,26.45 180 bottom
LED26  22.7,11.85 90 top
P1  31.1,17.25 270 bottom
Q1  8.3,23.55 90 bottom
Q2  5.5,23.55 90 bottom
R1  22.5,22.25 0 top
R2  22.5,21.25 0 top
R3  22.5,20.25 0 top
R4  22.5,18.35 0 top
R5  22.5,19.25 0 top
R6  22.5,17.45 0 top
R7  22.5,15.65 0 top
R8  22.5,16.55 0 top
R10  21.2,23.95 90 bottom
R11  26.4,23.65 90 bottom
R12  5.65,21.25 0 bottom
R13  8.3,21.45 0 bottom
R14  8.5,25.75 180 bottom
R15  5.5,25.75 0 bottom
R16  20.2,12.95 0 top
R17  20.2,12.05 0 top
R18  13,3.25 180 bottom
R19  3.3,21.15 0 bottom
R20  23.8,6.95 0 bottom
R21  20.7,6.65 90 bottom
R22  18,8.15 190 top
R23  20.3,9.25 100 top
R24  13.7,9.45 280 top
R25  20.2,11.05 0 top
S2  1.5,17.35 270 bottom
U1  7.2,20.55 180 top
U2  7.2,17.35 0 bottom
U3  23.9,23.95 0 bottom
U4  7.3,10.65 90 bottom
U5  17.2,18.35 90 top
U6  16.65,10.05 190 top
U18  23.6,16.65 180 bottom
X1  9.4,9.95 330 top
X2  12.2,25.55 90 top

### Tracks (layer width: path | path; a pad name or v marks a point on that pad's centre or on a via)
+3V3  (via drill 0.3, 0.35)
  Top 0.152: 15.31,8.45 15.31,7.95 C28.2 14.4,7.75 v14.1,8.05
  Top 0.2: C13.1 v13.97,14.87 14.2,15.1 U5.48 | R24.2 13.89,9.06 U6.8 15.31,8.99 15.31,8.45 15.31,7.75
  Top 0.254: 21.13,14.75 v21.13,15.49 20.48,16.15 U5.13 | 21.13,14.75 21.13,14.55 C15.1 | C1.2 C2.2 7.7,18.45 U1.16 7.91,19.55 U1.1 8.81,19.55 9.75,18.61 v9.75,18.4 | C14.1 13.3,22.45 v13.95,21.8 14.4,21.35 U5.36 | R22.1 19.87,8.24 R23.1 20.78,9.15 v21.3,9.15 | R24.2 13.79,8.36 v14.1,8.05 | LED26.A 23.15,13 22.65,13.5 22.42,13.5 21.17,14.75 21.13,14.75
  Bottom 0.152: C7.2 4.78,14.7 | C7.2 4.78,14.7 | 4.78,14.7 5.01,14.46 | C7.2 4.87,14.87 4.87,14.6 5.21,14.26 | C7.2 4.8,14.8 4.8,14.9
  Bottom 0.254: U4.3 6.49,9.54 6.49,10.79 | C8.2 7.9,9.05 U4.1 8.25,10.5 7.96,10.79 6.49,10.79 | v21.13,15.49 21.29,15.33 21.97,15.33 21.99,15.35 U18.5 22.65,14.35 C10.2 | J2.1 12.5,1.95 R18.1 12.5,7.18 13.37,8.05 v14.1,8.05 | R15.1 R14.1 8.42,26.17 8.42,26.22 8.75,26.55 10.1,26.55 v10.2,26.45 | v6.7,23.75 6.3,23.35 4.48,23.35 4.32,23.19 4.32,21.67 R19.1 | 6.49,10.79 5.96,10.79 5.5,11.25 v5.5,12.4 5.7,12.6 5.7,13.78 5.21,14.26 5.01,14.46 4.78,14.7 | C7.2 4.78,14.7 | 4.78,14.7 4.9,14.7 | 4.8,14.9 4.8,14.85 | 4.87,14.87 5.75,15.75 U2.9 U2.10
  pour VDD: -1,29.75 -1,-0.25 33.5,-0.25 33.5,29.75
ANT
  Top 0.406: L3.2 18,27.1 C29.1 18.05,28.9 L4.1
B
  Top 0.152: R25.1 19.5,11.05 19.1,11.45 19.1,11.85 18.8,12.15 18.8,12.22 18.79,12.22 18.79,12.92 18.2,13.52 U5.9
BAT_CHRG
  Bottom 0.254: U3.1 24.85,23.17 24.58,23.43 23.97,24.05 21.84,24.05 21.24,23.45 R10.1
BUTTON  (via drill 0.3)
  Top 0.152: U5.42 14.13,18.48 13.76,18.48 13.53,18.25 v12.2,18.25
  VDD 0.152: v12.2,18.25 12.13,18.18 10.94,18.18 9.28,19.85 v5.2,19.85
  Bottom 0.152: v5.2,19.85 5,19.65 3.3,19.65 2.96,19.31 2.96,19.11 | R19.2 2.35,20.7 2.35,19.72 2.96,19.11 | S2.1 2.96,19.11
G
  Top 0.152: U5.10 18.6,13.55 19.1,13.05 19.1,12.35 19.4,12.05 R17.1
GND  (via drill 0.35)  (1 unrouted)
  Top 0.203: U5.31 17,22.8 C20.2 16.55,24.8 v16.9,25.15
  Bottom 0.254: C6.1 4.24,18.39 4.21,18.39 4.05,18.23 4.05,18.2 3.8,17.95 | U4.2 7.3,8.68 6.7,8.08 C8.1
  other vias: 20,2.25 9,2.25 15,33.25 8.5,32.25 14.7,27.15 10.1,24.65 9.7,13.15 13.6,11.05 13.2,6.95 12.5,30.65 19.2,26.35 19.2,25.15 19.2,23.85 24.3,12.45 22.1,23.35 6.3,14.15 5,13.55 15.8,11.55 18.1,11.75
  pour Top: -1,29.75 33.4,29.75 33.4,-0.35 -1,-0.35
  pour Bottom: -1,29.75 33.5,29.75 33.5,-0.55 -1,-0.55
  pour Top: 7,34.65 16.5,34.65 16.5,29.85 7,29.85
  pour Bottom (rank 2): 6.9,34.65 16.45,34.65 16.45,29.85 6.9,29.85
  cutout Top: 16.2,23.55 17.5,23.55 17.5,22.05 16.9,22.05 16.2,22.75
  pour GND: -1,29.75 -1,-0.25 33.5,-0.25 33.5,29.75
  pour GND: 6.9,34.65 16.5,34.65 16.5,29.85 16.6,29.75 6.9,29.75
H1  (via drill 0.3)  (1 unrouted)
  Top 0.152: LED9.C v1.5,18.69 | LED12.C v15.7,31.65 | 27.2,25.15 26.36,24.65 LED2.A | LED3.A 29.25,18 | 29.25,18 arc65 22.1,29.65 21.7,28.95 LED1.A v20.1,29.35 20.1,28.79 20.04,28.68 19.49,28.14 19.49,27.1 19.5,27.09 19.5,26.95 arc-45 24.2,22.25 R1.2 | LED6.C 14.25,2.7 arc99 29.25,18
  VDD 0.152: v20.1,29.35 16.6,29.35 15.7,30.25 v15.7,31.65 arc68 2.1,23.85 2.84,23.11 2.84,21.69 1.5,20.35 v1.5,18.69
H2  (via drill 0.3)  (1 unrouted)
  Top 0.152: LED11.C 9.17,29.32 v9.7,29.85 | v23.3,28.15 23.07,28.15 22.65,28.57 LED1.C 21.62,28.45 20.69,26.86 arc-35 25.1,21.25 R2.2 23.1,21.25 | 22.75,5.35 22.4,5.89 LED5.A | LED8.C v2.4,12.05 | v13.34,5.2 13.4,4.4 15.75,4.4 LED6.A 15.75,3 arc60 27.6,10.75 LED4.A 27.07,11.35 27.6,11.87 v27.6,11.95
  VDD 0.152: v2.4,12.05 arc45 6.1,6.95 6.9,7.95 arc42 13.3,5.25 arc95 v13.34,5.2 | v27.6,11.95 28.3,11.55 arc75 23.7,28.75 v23.3,28.15 21.68,28.75 19.88,28.75 19.58,29.04 16.47,29.04 15.66,29.85 10.37,29.85 v9.7,29.85
H3  (via drill 0.3, 0.35)  (3 unrouted)
  Top 0.152: LED7.A 8.5,4.46 | 8.52,4.4 v8.5,4.35 arc186 8.52,4.4 | LED8.A 2.9,9.35 | LED9.A 0.55,16.5 | LED10.C v4.19,25.45 | v1.9,22.95 arc90 8.5,4.46 | 8.5,4.46 arc90 8.52,4.4 | LED2.C v27.6,22.55 | LED4.C 26.29,9.82 25.75,8.86 v25.65,8.8 | R3.2 v25.1,20.25
  VDD 0.152: v27.6,22.55 27.53,22.48 arc-50 25.2,9.15 v25.65,8.8 25.8,8.65 26.5,8.25 arc-80 v8.5,4.35 | v25.1,20.25 26.5,18.85 26.5,18.15 27,17.65 28.05,17.65
  Bottom 0.152: v1.9,22.95 2.4,22.65 arc-10 v4.19,25.45
H4  (via drill 0.3, 0.35)  (1 unrouted)
  Top 0.152: LED12.A 14.25,31.4 arc65 2.1,23.85 LED10.A 2.89,23.31 2.31,22.07 v2.26,22.03 | LED11.A 7.33,28.84 7,29.35 | LED5.C 20.4,4.75 arc16 v20.27,4.64 | LED7.C 6.97,5.94 v6.68,6.22 | LED3.C v28.27,13.42 | R4.2 25.56,18.35 v25.66,18.25
  GND 0.152: v28.27,13.42 27.6,13.75 | 27.6,13.75 arc-50 20,5.25 arc-17 v20.27,4.64 | v25.66,18.25 27.6,16.31 27.6,13.75
  VDD 0.152: v2.26,22.03 1.6,22.35 arc75 6.31,5.71 v6.67,6.21 v6.68,6.22 arc10 9.5,4.55 9.4,4.25 arc45 20.6,4.15 v20.27,4.64
H5  (via drill 0.3)  (1 unrouted)
  Top 0.152: LED22.C 4.02,22.6 v3.64,22.01 | LED13.A 22.11,27.97 22.65,27.65 arc-27 25.45,24.9 25.49,24.83 | LED14.A 26.5,23.05 | 26.5,23.05 25.49,24.83 | 25.49,24.83 25.36,25.05 24.05,23.95 arc-30 25.91,19.25 R5.2 | 26.5,23.05 26.54,22.98 arc-30 27.37,20.6 26.57,19.79 26.57,17.5 27.2,16.88 LED15.A arc-30 v26.4,12.65 LED16.C | LED19.C 10.64,5.63 10.15,4.65 v10.15,4.62 | v23.97,27.61 23.96,27.6 23.55,27.05
  VDD 0.152: v26.4,12.65 arc-30 23.46,8.39 24,7.85 arc-60 v10.15,4.62 | v23.97,27.61 23.92,27.56 22.71,27.56 21.6,28.35 19.85,28.35 19.46,28.74 16.33,28.74 15.54,29.53 10.52,29.53 10.5,29.55 arc50 v3.64,22.01
H6  (via drill 0.3, 0.35)
  Top 0.152: LED21.A 2.15,18 2.15,18.5 | 2.15,18.5 2.15,16.1 arc28 3.2,11.95 3.5,11.45 | 2.15,18.5 arc-30 3.25,22.65 4.47,24.73 arc-35 8,27.95 LED23.C v7.45,26.89 | LED19.A 7.9,6.55 7.4,6.85 | 7.4,6.85 7.06,7.05 v7.02,7.05 | LED20.A 3.5,11.45 | 3.5,11.45 4.47,9.73 4.55,9.6 arc26 7.4,6.85 | LED17.C v23.06,7.84 | LED13.C v20.1,27.35 | R6.2 25.26,17.45 v25.96,16.75
  VDD 0.152: v7.02,7.05 arc80 v23.06,7.84 22.6,8.55 arc35 25.96,13.18 v25.96,16.75 | v20.1,27.35 19.8,27.35 19.3,27.85 15.45,27.85 14.1,29.2 10.75,29.2 arc20 7.53,26.99 arc52 v7.45,26.89
H7  (2 unrouted)
  Top 0.152: LED20.C 5.4,10.85 | LED18.A 14.25,5.7 | LED14.C 24.7,23.58 arc-35 26.27,18.68 26.27,17.38 26.57,17.07 26.57,16.05 arc-25 24.6,10.85 | LED16.A 24.6,10.85 | 24.6,10.85 arc-60 14.25,5.7 | LED17.A 20.42,6.3 20.1,6.85 | 5.4,10.85 arc50 14.25,5.7 | LED24.C 13.6,29.45 arc29 10.14,28.56 10.7,27.55 arc28 7.3,25.45 arc74 5.4,10.85 | 26.45,15.6 22.95,15.6 R7.2
H8  (via drill 0.3, 0.35)  (1 unrouted)
  Top 0.152: LED22.A 5.4,23.65 | LED23.A 9.63,28.14 | LED21.C 3.45,16.5 arc-38 5.4,23.65 | LED23.A 9.2,28.75 9.7,29.05 arc-34 13.85,30.1 15.75,30.1 LED24.A 15.75,28.9 v15.5,28.65 | LED23.A 9.68,28.09 | 5.4,23.65 arc-35 9.8,27.55 LED23.A | LED18.C 16.5,5.05 16.5,4.45 arc30 20.3,5.45 22.45,6.69 22.65,6.8 arc27 25.5,9.75 26.8,11.95 arc31 27.87,15.78 27.87,17.33 LED15.C 27.2,18.91 v27.24,18.95 | R8.2 24.52,16.55 v24.57,16.59
  VDD 0.152: 22.1,27.55 arc-60 v27.24,18.95 | 22.1,27.55 21.37,27.96 19.73,27.96 19.34,28.35 15.8,28.35 v15.5,28.65 | 22.1,27.55 | v24.57,16.59 24.49,16.67 24.49,20.94 25.29,21.74 26.76,21.74
INT  (via drill 0.3)
  Top 0.152: U1.7 7.2,22.05 7.5,22.35 8.8,22.35 9.9,21.25 9.9,20.55 10.24,20.21 v10.65,20.21 | v12.9,18.85 13,18.95 U5.41
  Bottom 0.152: v10.65,20.21 11.1,20.21 12.46,18.85 v12.9,18.85
N$3
  Bottom 0.254: R10.2 21.2,25.3 LED25.C
N$4
  Top 0.2: C16.1 13.4,13.3 13.8,13.3 15,14.49 U5.1
N$5
  Bottom 0.254: U3.5 24.85,24.6 25.4,24.05 26.3,24.05 R11.2
N$6
  Top 0.152: C18.1 15.8,22.85 15.97,22.68 16.54,22.11 16.54,21.74 16.6,21.68 U5.32
N$7
  Top 0.152: LED26.B 23.15,10.6 22.7,10.15 21.1,10.15 20.7,10.55 R25.2
N$8
  Top 0.152: C17.1 14.7,23.51 16.23,21.98 16.23,21.38 U5.33
N$9
  Top 0.2: U5.46 10.2,16.95 C19.2 9.35,16.1 9.35,15.17 9.3,15.12 L2.2
N$10
  Top 0.2: U5.47 13.6,16.55 L1.1
N$11
  Top 0.2: L1.2 10.78,15.85 L2.1
N$12
  Top 0.254: U5.30 17.4,22.8 C20.1
  Top 0.406: C20.1 18,23.4 | 18,23.4 L3.1 | C20.1 18,23.4 | 18,23.4 L3.1 | C20.1 18,23.4 | 18,23.4 L3.1
N$13
  Top 0.152: U5.2 15.4,14.18 12.39,11.17 10.8,11.17 10.48,10.85 8.66,10.85 X1.P$2 8.36,10.98 C21.1
N$14
  Top 0.152: U5.3 15.8,14.15 12.52,10.87 11.16,10.87 10.54,10.25 10.54,9.85 10.44,9.95 X1.P$1 10.48,9.31 11.3,9.31 | C22.1 11.3,9.31 | 11.3,9.31 11.08,9.31
N$15
  Top 0.152: U5.34 15.8,21.98 13.7,24.08 13.7,25 13.15,25.55 12.3,25.55 11.63,26.22 11.63,26.28 X2.3 12.12,26.77 12.12,26.82 12.75,27.45 C23.2
N$16
  Top 0.152: 13.7,23.65 13.75,23.6 | X2.1 12.75,23.75 C24.2 13.7,23.65 | 13.7,23.65 13.75,23.6 | 13.75,23.6 15.4,21.95 U5.35
N$17
  Top 0.254: C25.2 12.89,21.3 13.64,20.55 U5.37
N$18
  Top 0.152: U6.3 18.8,10.54 18.99,10.36 19.45,10.36 20.07,9.74 R23.2
N$19
  Top 0.152: R24.1 13.81,9.74 14.37,9.74 14.56,9.56 U6.7
N$20
  Top 0.406: L4.2 18.15,32.67 AE1.1
N$21
  Top 0.152: LED26.R 21,12.65 R16.2
N$22
  Top 0.152: LED26.G 21.7,11.05 R17.2
R
  Top 0.152: U5.11 19,13.95 19.7,13.25 R16.1
RESET  (via drill 0.3)
  Top 0.152: U5.24 20.2,21.15 v20.3,21.25
  Bottom 0.152: v20.3,21.25 20.3,19.85 19.74,19.29 19.74,9.32 13.66,3.25 R18.2
  Bottom 0.254: R18.2 13.5,1.65 J2.2
SCL  (via drill 0.3)
  Top 0.152: U5.39 13.57,19.75 13.25,19.43 12.66,19.43 12.29,19.07 11.6,19.07 v11.3,18.77 10.25,18.77 8.97,20.05 U1.2
  Bottom 0.152: R15.2 5.5,25.25 Q2.3 5.56,24.46 7.1,24.46 7.81,23.75 8.93,23.75 9.57,23.11 9.57,19.51 10.31,18.77 v11.3,18.77
SCL_1.8V
  Bottom 0.152: U2.2 8.34,19.01 7.94,19.01 6.8,20.15 6.25,20.15 R12.2 5.15,22.28 Q2.2
SDA  (via drill 0.3)
  Top 0.152: U5.38 C26.2 12.07,19.37 10.6,19.37 v10.6,19.35 10.1,19.35 8.9,20.55 U1.3
  Bottom 0.152: R14.2 9,25.22 Q1.3 8.66,24.16 8.95,24.16 9.97,23.14 9.97,19.61 10.23,19.35 v10.6,19.35
SDA_1.8V
  Bottom 0.152: U2.3 8.75,18.63 8.75,20.45 7.8,21.4 R13.2 7.6,21.65 7.6,22.53 Q1.2
SPI_MISO
  Top 0.152: U6.2 18.07,10.08 17.49,10.08 16.87,10.7 16.87,10.94 16.5,11.31 16.5,12.75 17,13.25 U5.6
SPI_MOSI
  Top 0.152: U5.5 16.6,13.45 14.92,11.77 14.92,10.74 U6.5
SPI_SCK
  Top 0.152: U5.4 16.2,13.85 14.3,11.95 14.3,10.25 14.5,10.05 U6.6
SPI_SS  (via drill 0.3, 0.35)
  Top 0.152: R22.2 17.53,8.19 17.53,8.91 U6.1 18.91,9.56 v19.1,9.75 | U5.8 17.8,13.05 v18.2,12.65
  Bottom 0.152: v19.1,9.75 19.1,10.95 19.1,11.75 v18.2,12.65
SWDCLK  (via drill 0.3)
  Top 0.152: U5.25 19.4,21.85 19.66,22.11 v20.2,22.11
  Bottom 0.152: v20.2,22.11 20.5,22.11 20.95,21.66 20.95,20.07 20.04,19.16 20.04,9.2 15.1,4.25 J2.3
SWDIO  (via drill 0.3)
  Top 0.152: U5.26 19,22.25 v19.5,22.75
  Bottom 0.152: v19.5,22.75 20.43,22.75 21.3,21.88 21.3,19.9 20.35,18.95 20.35,9.07 16.6,5.32 J2.4
T1
  Top 0.152: R1.1 20.88,21.13 20.88,20.07 20.54,19.72 20.23,19.72 U5.22
T2
  Top 0.152: R2.1 21.83,21.25 21.23,20.66 21.23,19.99 20.57,19.32 20.23,19.32 U5.21
T3
  Top 0.152: U5.20 20.22,18.97 20.75,18.97 21.47,19.69 21.6,19.83 21.6,20.05 21.8,20.25 R3.1
T4
  Top 0.152: R4.1 21.3,18.35 21.07,18.12 20.23,18.12 U5.18
T5
  Top 0.152: R5.1 21.46,19.25 20.73,18.52 20.23,18.52 U5.19
T6
  Top 0.152: U5.17 21.7,17.75 R6.1
T7
  Top 0.152: R7.1 21.93,15.65 20.63,16.95 U5.15
T8
  Top 0.152: R8.1 21.63,16.55 20.83,17.35 U5.16
VBAT
  Bottom 0.254: 25.77,9.85 J1.1 25.77,9.85 | 24.55,18.05 U18.3 25.3,17.2 25.3,10.45 25.24,10.39 | U18.1 22.65,17.4 23.1,16.95 23.9,16.95 24.75,17.8 24.75,17.85 24.55,18.05 | 24.55,18.05 24.55,18.85 C12.2 23.65,20.35 C4.2 23.65,21.55 22.95,22.25 U3.3 | R20.1 24.3,9.45 25.24,10.39 | 25.77,9.85 25.24,10.39
VBAT_LVL  (via drill 0.35)
  Top 0.152: v17.11,12.35 17.4,12.64 U5.7
  GND 0.152: v19.66,7.48 17.2,9.94 17.2,12.35 v17.11,12.35
  Bottom 0.152: R21.1 19.7,7.15 19.7,7.52 v19.66,7.48
  Bottom 0.254: R20.2 22.5,6.15 C27.1 21.3,6.15 R21.1
VBUS
  Bottom 0.254: LED25.A 22.6,27.2 C5.2 23.15,25.45 U3.4 23.52,25.25 25.56,23.21 25.56,22.79 26.43,21.92 26.43,19.32 26.61,19.14 26.61,18.69 26.98,18.32 27.51,18.32 27.74,18.55 P1.1
VCC
  Bottom 0.152: Q2.1 6.58,22.58 7.3,23.3 8,23.3 8.72,22.58 Q1.1
  Bottom 0.254: C9.2 8.25,13.2 U4.5 | C9.2 8.1,13.58 7.2,14.48 7.2,16.85 7.1,16.95 6.7,17.35 U2.11 5,17.35 C6.2 | Q1.1 8.8,22.43 R13.1 9.11,21.14 9.11,14.36 C9.2 | Q2.1 R12.1

### Text on the board
209bmp: LEDWatch v1 / Rayan